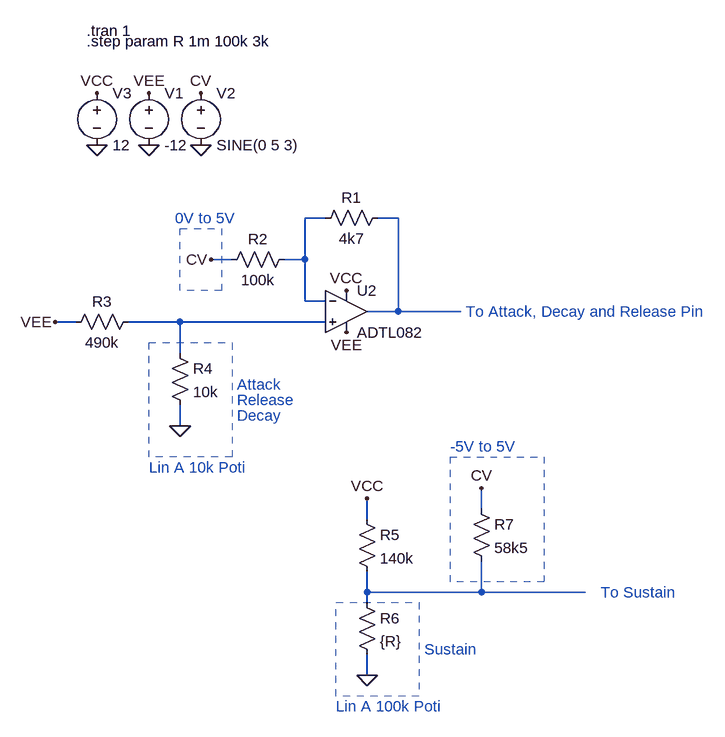
[diagram p0: schematic CV Inputs.asc]
CV Inputs.asc, the LTspice schematic file:
Version 4
SHEET 1 1748 1216
WIRE 240 192 208 192
WIRE 352 192 320 192
WIRE 96 256 64 256
WIRE 208 256 208 192
WIRE 208 256 176 256
WIRE 208 320 208 256
WIRE 240 320 208 320
WIRE 352 336 352 192
WIRE 352 336 304 336
WIRE 448 336 352 336
WIRE -144 352 -176 352
WIRE 16 352 -64 352
WIRE 240 352 16 352
WIRE 16 400 16 352
WIRE 16 512 16 480
WIRE 480 640 480 608
WIRE 304 656 304 624
WIRE 304 768 304 736
WIRE 480 768 480 720
WIRE 480 768 304 768
WIRE 640 768 480 768
WIRE 304 784 304 768
WIRE 304 896 304 864
FLAG -112 80 0
FLAG -32 80 0
FLAG 48 80 0
FLAG -112 0 VCC
FLAG -32 0 VEE
FLAG 48 0 CV
FLAG 272 368 VEE
FLAG 272 304 VCC
FLAG 64 256 CV
FLAG 16 512 0
FLAG -176 352 VEE
FLAG 304 624 VCC
FLAG 304 896 0
FLAG 480 608 CV
SYMBOL voltage -32 -16 R0
WINDOW 123 0 0 Left 0
WINDOW 39 0 0 Left 0
SYMATTR InstName V1
SYMATTR Value -12
SYMBOL voltage 48 -16 R0
WINDOW 123 0 0 Left 0
WINDOW 39 0 0 Left 0
SYMATTR InstName V2
SYMATTR Value SINE(0 5 3)
SYMBOL voltage -112 -16 R0
WINDOW 123 0 0 Left 0
WINDOW 39 0 0 Left 0
SYMATTR InstName V3
SYMATTR Value 12
SYMBOL res 336 176 R90
WINDOW 0 0 56 VBottom 2
WINDOW 3 32 56 VTop 2
SYMATTR InstName R1
SYMATTR Value 4k7
SYMBOL res 192 240 R90
WINDOW 0 0 56 VBottom 2
WINDOW 3 32 56 VTop 2
SYMATTR InstName R2
SYMATTR Value 100k
SYMBOL OpAmps\\ADTL082 272 272 R0
SYMATTR InstName U2
SYMBOL res -160 368 R270
WINDOW 0 32 56 VTop 2
WINDOW 3 0 56 VBottom 2
SYMATTR InstName R3
SYMATTR Value 490k
SYMBOL res 0 384 R0
SYMATTR InstName R4
SYMATTR Value 10k
SYMBOL res 288 640 R0
SYMATTR InstName R5
SYMATTR Value 140k
SYMBOL res 288 768 R0
SYMATTR InstName R6
SYMATTR Value {R}
SYMBOL res 464 624 R0
SYMATTR InstName R7
SYMATTR Value 58k5
TEXT -128 -96 Left 2 !.tran 1
TEXT -32 576 Left 2 ;Lin A 10k Poti
TEXT 456 336 Left 2 ;To Attack, Decay and Release Pin
TEXT 8 192 Left 2 ;0V to 5V
TEXT -128 -80 Left 2 !.step param R 1m 100k 3k
TEXT 664 768 Left 2 ;To Sustain
TEXT 432 544 Left 2 ;-5V to 5V
TEXT 104 448 Left 2 ;Attack
TEXT 104 472 Left 2 ;Release
TEXT 104 496 Left 2 ;Decay
TEXT 256 944 Left 2 ;Lin A 100k Poti
TEXT 392 856 Left 2 ;Sustain
RECTANGLE Normal 96 560 -32 384 2
RECTANGLE Normal 80 304 16 208 2
RECTANGLE Normal 576 752 432 560 2
RECTANGLE Normal 384 928 256 784 2

The netlist it stands for:
* CV Inputs.asc
V1 VEE 0 -12
V2 CV 0 SINE(0 5 3)
V3 VCC 0 12
R1 N002 N001 4k7
R2 N001 CV 100k
XU2 N003 N001 VCC VEE N002 ADTL082  ; pins In+ In- V+ V- OUT
R3 VEE N003 490k
R4 N003 0 10k
R5 VCC N004 140k
R6 N004 0 {R}
R7 CV N004 58k5
.tran 1
* Lin A 10k Poti
* To Attack, Decay and Release Pin
* 0V to 5V
.step param R 1m 100k 3k
* To Sustain
* -5V to 5V
* Attack
* Release
* Decay
* Lin A 100k Poti
* Sustain
.lib ADI.lib
.backanno
.end